# EAGLE design Side_ShortE (EAGLE 9.4.2)
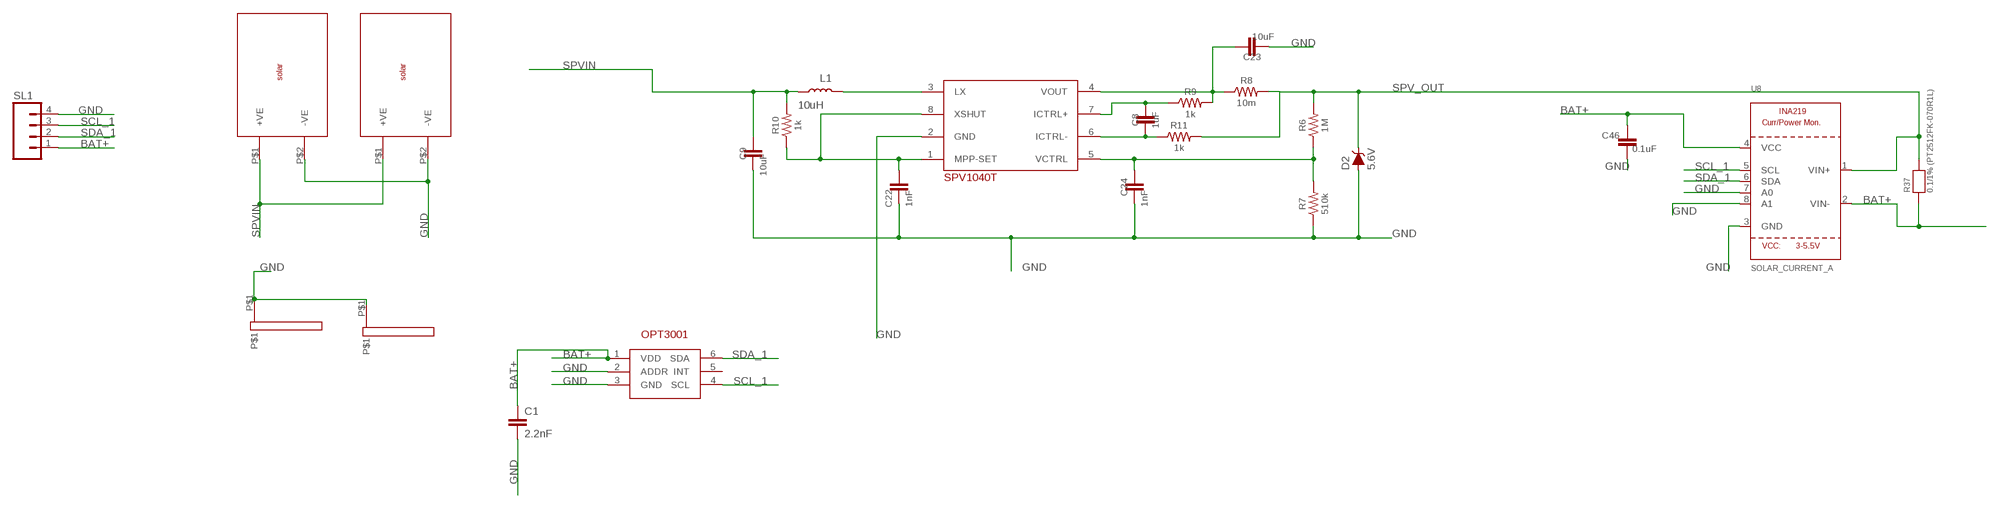
[diagram p0: schematic, sheet 1]

## Parts
C1  2.2nF  2.2NF/2200PF-0603-50V-10%  [0603]
C8  1uF  10UF-0603-6.3V-20%  [0603]
C9  10uF  10UF-0603-6.3V-20%  [0603]
C22  1nF  10UF-0603-6.3V-20%  [0603]
C23  10uF  10UF-0603-6.3V-20%  [0603]
C24  1nF  10UF-0603-6.3V-20%  [0603]
C46  0.1uF  10UF-0603-6.3V-20%  [0603]
D2  5.6V  DIODE-ZENER-MMSZ5232BS  [SOD-323]
L1  10uH  INDUCTOR-0603-33NH  [0603]
R6  1M  RC0603JR-070RL  [RES_0603]
R7  510k  RC0603JR-070RL  [RES_0603]
R8  10m  RC0603JR-070RL  [RES_0603]
R9  1k  RC0603JR-070RL  [RES_0603]
R10  1k  RC0603JR-070RL  [RES_0603]
R11  1k  RC0603JR-070RL  [RES_0603]
R37  0.1/1% (PT2512FK-070R1L)  RESISTOR2512  [2512]
SL1  M04  [04P]
SPV_A  SPV1040T_  [SOP65P640X120-8N]
U1  SON65P200X200X65-7N  [SON65P200X200X65-7N]
U8  SOLAR_CURRENT_A  INA219  [SOT23-8]
U$1  16X2  [16X2]
U$2  16X2  [16X2]
U$3  SOLAR_50_5_2  [FOOT]
U$4  SOLAR_50_5_2  [FOOT]

## Nets
BAT+ [vcc]: C1.1 C46.1 R37.1 SL1.1 U1.1(VDD) U8.2(VIN-) U8.4(VCC)
GND [vcc]: C1.2 C9.2 C22.2 C23.2 C24.2 C46.2 D2.A R7.1 SL1.4 SPV_A.2(GND) U1.2(ADDR) U1.3(GND) U8.3(GND) U8.7(A0) U8.8(A1) U$1.P$1 U$2.P$1 U$3.P$2(-VE) U$4.P$2(-VE)
N$5: L1.2 SPV_A.3(LX)
N$31: C22.1 R10.1 SPV_A.1(MPP-SET) SPV_A.8(XSHUT)
N$32: C24.1 R6.1 R7.2 SPV_A.5(VCTRL)
N$34: C8.2 R11.1 SPV_A.6(ICTRL-)
N$35: C8.1 R9.1 SPV_A.7(ICTRL+)
N$36: C23.1 R8.1 R9.2 SPV_A.4(VOUT)
SCL_1: SL1.3 U1.4(SCL) U8.5(SCL)
SDA_1: SL1.2 U1.6(SDA) U8.6(SDA)
SPV_OUT: D2.C R6.2 R8.2 R11.2 R37.2 U8.1(VIN+)
SPVIN: C9.1 L1.1 R10.2 U$3.P$1(+VE) U$4.P$1(+VE)
Unconnected: U1.5(INT)

## Library data of the parts
C1 = SparkFun-Capacitors:2.2NF/2200PF: 2.2nF/2,200pF ceramic capacitors A capacitor is a passive two-terminal electrical component used to store electrical energy temporarily in an electric field.; PROD_ID: CAP-07877
C8 C22 C24 C46 = SparkFun-Capacitors:10UF: 10.0µF ceramic capacitors A capacitor is a passive two-terminal electrical component used to store electrical energy temporarily in an electric field.; PROD_ID: CAP-11015; VALUE: 10uF
C9 C23 = SparkFun-Capacitors:10UF: 10.0µF ceramic capacitors A capacitor is a passive two-terminal electrical component used to store electrical energy temporarily in an electric field.; PROD_ID: CAP-11015
D2 = SparkFun-DiscreteSemi:DIODE-ZENER: Zener Diode A Zener diode allows current to flow from its anode to its cathode like a normal semiconductor diode, but it also permits current to flow in the reverse direction when its "Zener voltage" is reached. - WIkipedia; PROD_ID: DIO-12442
L1 = SparkFun-Coils:INDUCTOR: Inductors Resist changes in electrical current. Basically a coil of wire. SparkFun Products: SparkFun Load Cell Amplifier - HX711 <https://www.sparkfun.com/products/13879> IOIO-OTG - V2.2 <https://www.sparkfun.com/products/13613>; PROD_ID: NDUC-07874; VALUE: 33nH/±5%/500mA
R6-R11 = Resistor_Capacitor:RC0603JR-070RL: RES SMD 0 OHM JUMPER 1/10W 0603 Manufacturer's datasheet <http://www.yageo.com/documents/recent/PYu-RC_Group_51_RoHS_L_10.pdf>; CREATED_BY: PCBLayout.com; DIGIKEY_PART_NUMBER: 311-0.0GRTR-ND; MANUFACTURER: Yageo; MPN: RC0603JR-070RL; PACKAGE: SMD 0603
R37 = microbuilder:RESISTOR: Resistors 0402 - 0402 Surface Mount Package 22 Ohm 1% 1/16W [Digikey: 311-22.0LRTR-ND] 33 Ohm 5% 1/16W 1.0K 5% 1/16W 1.5K 5% 1/16W 2.0K 1% 1/16W 10.0K 1% 1/16W [Digikey: 311-10.0KLRTR-ND] 10.0K 5% 1/16W [Digikey: RMCF0402JT10K0TR-ND] 12.1K 1% 1/16W [Digikey: 311-22.0LRTR-ND] 100.0K 5% 1/16W 0603 - 0603 Surface Mount Package 0 Ohm 1/10 Watt 1% Resistor 15 Ohm 1/10 Watt 1% Resistor 33 Ohm 1/10 Watt 1% Resistor 49.9 Ohm 1/10 Watt 1% Resistor 100 Ohm 1/10 Watt 1% Resistor 150 Ohm 1/10 Watt 1% Resistor 240 Ohm 1/10 Watt 1% Resistor 390 Ohm 1/10 Watt 1% Resistor 560 Ohm 1/10 Watt 1% Resistor 680 Ohm 1/10 Watt 1% Resistor 750 Ohm 1/10 Watt 1% Resistor 1.0K Ohm 1/10 Watt 1% Resistor 1.5K Ohm 1/10 Watt 1% Resistor 2.0K Ohm 1/10 Watt 1% Resistor 2.2K Ohm 1/10 Watt 1% Resistor 3.3K Ohm 1/10 Watt 1% Resistor 4.7K Ohm 1/10 Watt 1% Resistor 10.0K Ohm 1/10 Watt 1% Resistor 12.0K Ohm 1/10 Watt 1% Resistor 12.1K Ohm 1/10 Watt 1% Resistor 20.0K Ohm 1/10 Watt 1% Resistor 33.0K Ohm 1/10 Watt 1% Resistor 100.0K Ohm 1/10 Watt 1% Resistor 0805 - 0805 Surface Mount Package 0 Ohm 1/8 Watt 1% Resistor 33 Ohm 1/8 Watt 1% Resistor 100 Ohm 1/8 Watt 1% Resistor 150 Ohm 1/8 Watt 1% Resistor 200 Ohm 1/8 Watt 1% Resistor 240 Ohm 1/8 Watt 1% Resistor 330 Ohm 1/8 Watt 1% Resistor 390 Ohm 1/8 Watt 1% Resistor 470 Ohm 1/8 Watt 1% Resistor 1.0K Ohm 1/8 Watt 1% Resistor 1.5K Ohm 1/8 Watt 1% Resistor 2.0K Ohm 1/8 Watt 1% Resistor 4.7K Ohm 1/8 Watt 1% Resistor 5.1K Ohm 1/8 Watt 1% Resistor 5.6K Ohm 1/8 Watt 1% Resistor 10.0K Ohm 1/8 Watt 1% Resistor 22.0K Ohm 1/8 Watt 1% Resistor 33.0K Ohm 1/8 Watt 1% Resistor 100K Ohm 1/8 Watt 1% Resistor 1206 - 1206 Surface Mount Package 2012 - 2010 Surface Mount Package 0.11 Ohm 1/2 Watt 1% Resistor - Digikey: RHM.11UCT-ND
SL1 = con-amp-quick:M04: AMP QUICK CONNECTOR; OC_FARNELL: unknown; OC_NEWARK: unknown
SPV_A = SPV1040T:SPV1040T_
U1 = SON65P200X200X65-7N:SON65P200X200X65-7N; A_MAX: 0.65; B_MAX: 0.3; B_MIN: 0.2; B_NOM: 0.25; D2_NOM: 1.35; D_MAX: 2.075; D_MIN: 1.925; D_NOM: 2.0; E2_NOM: 0.65; ENOM: 0.65; E_MAX: 2.075; E_MIN: 1.925; E_NOM: 2.0; L_MAX: 0.35; L_MIN: 0.25; L_NOM: 0.3; MANUFACTURER: Maxim Integrated; PIN_COUNT: 6.0; SNAPEDA_PACKAGE_ID: 71138; STANDARD: IPC 7351B
U8 = microbuilder:INA219: INA219 - I2C Current/Power Monitor Voltage Range: 0-26V Accuracy: 0.5% Temperature: -40°C - 125°C
U$1 U$2 = 16x2PAD:16X2: Pad for 90 degree solder
U$3 U$4 = solar_50_5_2:SOLAR_50_5_2

## Net classes
1 vcc: width 0.254 mm

## Board
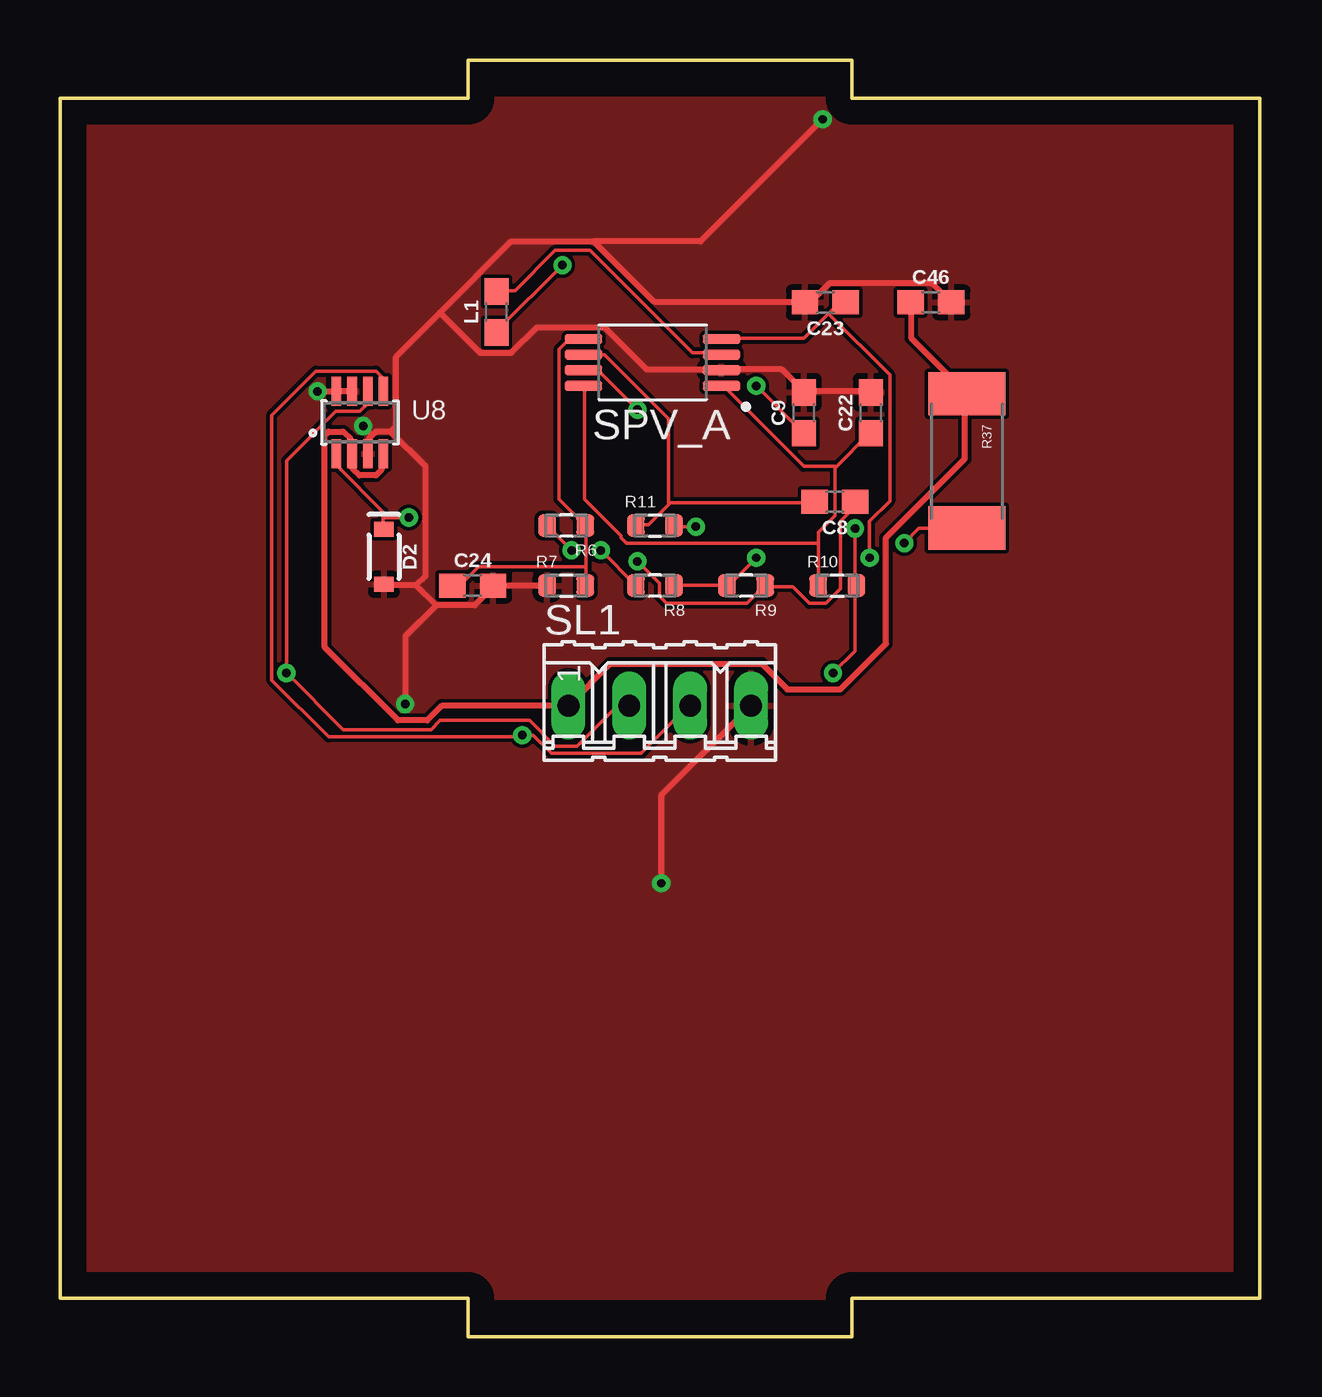
[diagram p1: board, top side]
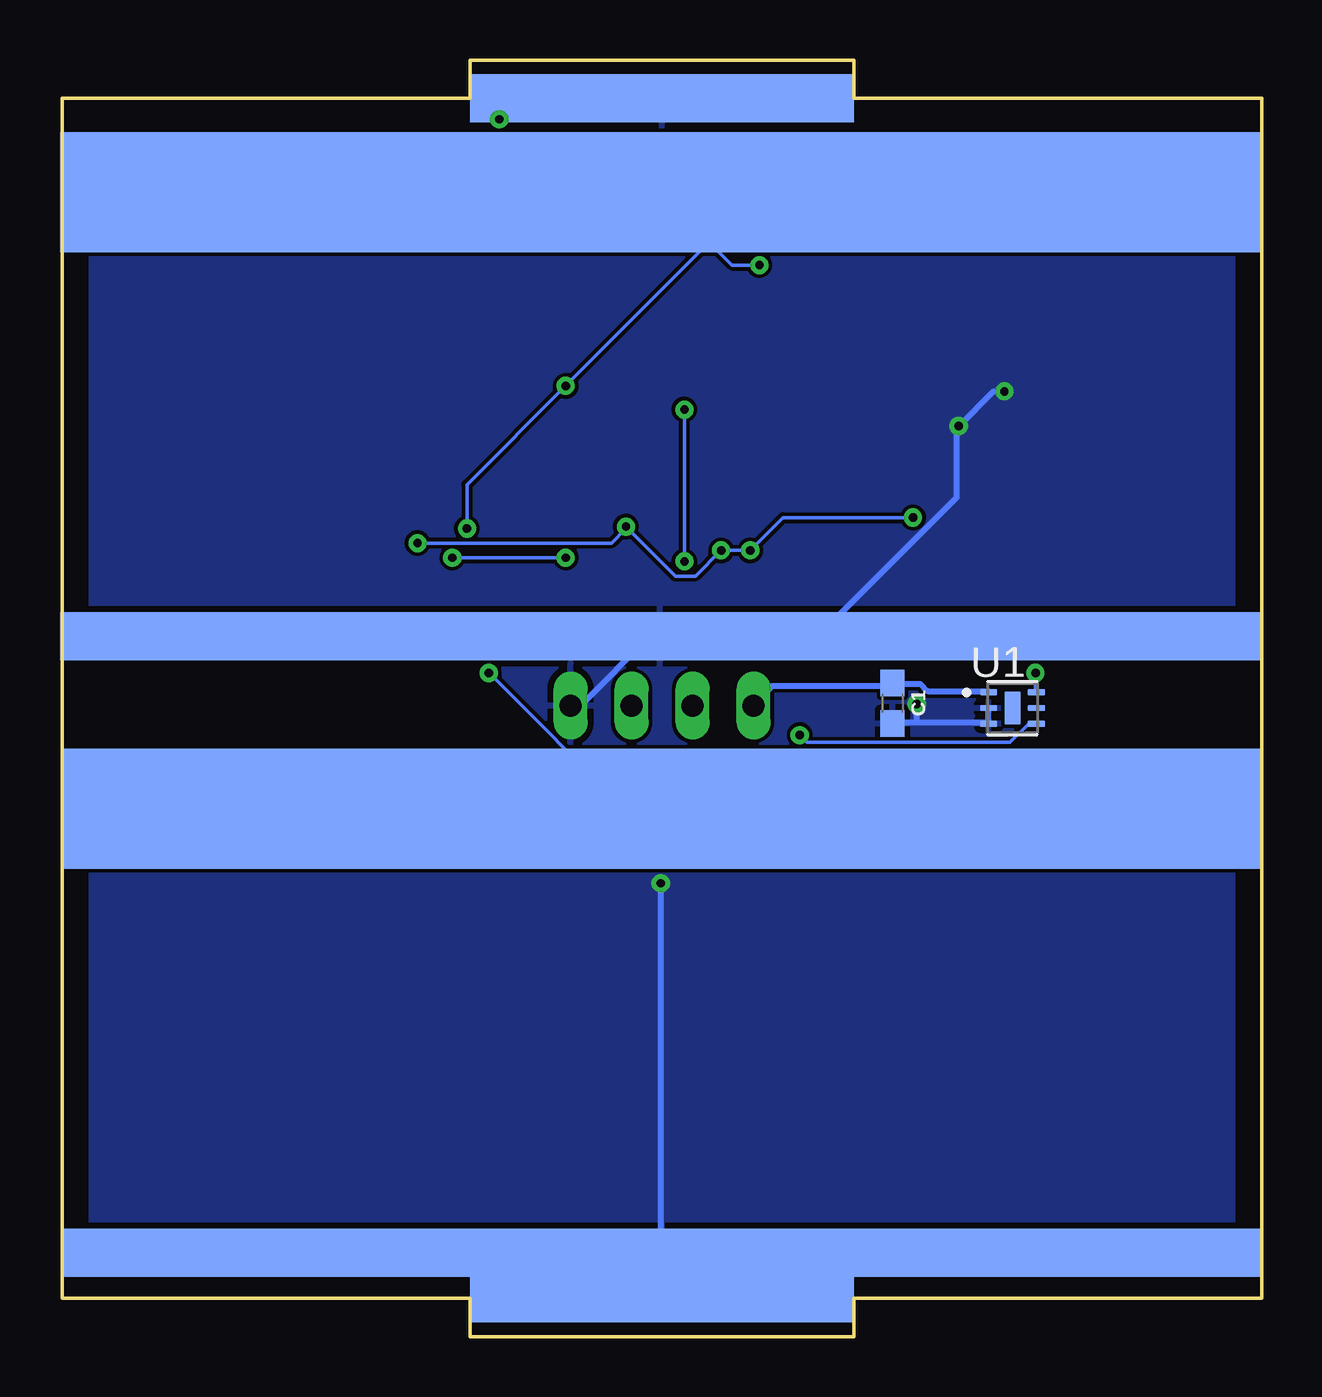
[diagram p2: board, bottom side, seen from below]

Size 50 x 53.2 mm. Coordinates in mm from the lower left corner, seen from the top.
Outline: 0,1.6 17,1.6 17,0 33,0 33,1.6 50,1.6 50,51.6 33,51.6 33,53.2 17,53.2 17,51.6 0,51.6 0,1.6
Copper layers (1*16): Top 0.035mm / dielectric 1.5mm / Bottom 0.035mm
Design rules "default *": minimum track width 6mil, minimum drill 0.35mm, track to track 6mil, track to pad 6mil, pad to pad 6mil, via to via 6mil, smd to smd 6mil, copper to edge 40mil, drill to drill 6mil, minimum pad ring 10mil, minimum via ring 8mil, stop-mask expansion 4mil, vias tented up to drill 0mil, thermal gap 10mil

### Footprints (pad centres in the part's own frame; a part is rotated, then mirrored left to right if it is on the bottom)
0603 = smd 1.1 x 1: 1 -0.85,0; 2 0.85,0
SOD-323 = smd 0.63 x 0.83: A 1.15,0; C -1.15,0
RES_0603 = smd 0.74 x 0.93: 1 -0.795,0; 2 0.795,0
2512 = smd 1.8 x 3.2: 1 -2.8,0; 2 2.8,0
04P = drill 0.914 long: 1 -3.81,0; 2 -1.27,0; 3 1.27,0; 4 3.81,0
SOP65P640X120-8N = smd 1.56 x 0.41: 1 -2.88,0.975; 2 -2.88,0.325; 3 -2.88,-0.325; 4 -2.88,-0.975; 5 2.88,-0.975; 6 2.88,-0.325; 7 2.88,0.325; 8 2.88,0.975
SON65P200X200X65-7N = smd 0.72 x 0.27: 1 -0.995,0.65; 2 -0.995,0; 3 -0.995,-0.65; 4 0.995,-0.65; 5 0.995,0; 6 0.995,0.65 | smd 0.65 x 1.35: 7 0,0
SOT23-8 = smd 0.4 x 1.2: 1 -0.975,-1.3; 2 -0.325,-1.3; 3 0.325,-1.3; 4 0.975,-1.3; 5 0.975,1.3; 6 0.325,1.3; 7 -0.325,1.3; 8 -0.975,1.3
16X2 = smd 16 x 2: P$1 0,0
FOOT = smd 50 x 5: P$1 0,0 | smd 50 x 2: P$2 0,18.5

### Placement (x,y rotation side)
C1  15.4,26.4 270 bottom
C8  32.3,34.8 180 top
C9  31,38.5 90 top
C22  33.8,38.5 90 top
C23  31.9,43.1 180 top
C24  17.2,31.3 0 top
C46  36.3,43.1 0 top
D2  13.5,32.5 270 top
L1  18.2,42.7 90 top
R6  21.1,33.8 180 top
R7  21.1,31.3 0 top
R8  24.8,31.3 180 top
R9  28.6,31.3 180 top
R10  32.4,31.3 0 top
R11  24.8,33.8 0 top
R37  37.8,36.5 270 top
SL1  25,26.3 0 top
SPV_A  24.7,40.6 180 top
U1  10.4,26.2 0 bottom
U8  12.5,38.1 0 top
U$1  25,51.6 0 bottom
U$2  25,1.6 0 bottom
U$3  25.1,47.7 180 bottom
U$4  25,22 180 bottom

### Tracks (layer width: path | path; a pad name or v marks a point on that pad's centre or on a via)
BAT+
  Top 0.254: C46.1 35.5,43.05 35.5,41.61 37.79,39.32 R37.1 37.71,39.24 37.71,36.58 34.43,33.3 34.43,28.88 32.53,26.98 30.32,26.98 29.25,28.04 22.93,28.04 21.25,26.37 SL1.1 21.17,26.29 15.92,26.29 15.31,25.68 14.09,25.68 11.04,28.73 11.04,37.57 11.19,37.72 11.8,37.72 12.11,37.41 12.11,36.88 U8.2 12.18,36.73 12.18,36.2 12.49,35.89 13.17,35.89 13.4,36.12 13.4,36.73 U8.4
  Bottom 0.254: U1.1 11.42,26.9 13.94,26.9 14.24,27.2 15.38,27.2 C1.1 15.46,27.13 20.41,27.13 21.17,26.37 SL1.1
GND  (via drill 0.35)
  Top 0.254: C22.2 33.75,39.4 31,39.4 C9.2 30.93,39.47 30.09,40.31 27.65,40.31 SPV_A.2 27.5,40.31 24.45,40.31 22.7,42.06 19.88,42.06 18.81,41 17.52,41 15.84,42.67 | C46.2 37.1,43.13 36.34,43.89 32.07,43.89 31.31,43.13 31.08,43.13 C23.2 30.93,43.13 24.76,43.13 22.24,45.64 | U8.7 12.11,39.4 11.57,39.4 U8.8 11.42,39.4 v10.73,39.4 | 14.85,31.32 13.55,31.32 D2.A | 15.69,30.48 14.85,31.32 | 15.69,30.48 17.29,30.48 18.05,31.24 C24.2 18.13,31.32 20.26,31.32 R7.1 | 13.02,37.57 13.17,37.72 13.78,37.72 | 13.02,37.57 12.87,37.41 12.87,36.8 U8.3 | 13.78,37.72 15.23,36.27 15.23,31.7 14.85,31.32 | 13.02,37.57 v12.64,37.95 | v14.39,26.37 14.39,29.18 15.69,30.48 | 22.24,45.64 18.81,45.64 15.84,42.67 | 15.84,42.67 14.01,40.84 14.01,37.95 13.78,37.72 | v25.06,18.9 25.06,22.55 28.79,26.29 SL1.4 | v31.79,50.73 26.7,45.64 22.24,45.64
  Bottom 0.254: U$2.P$1 25.06,1.6 25.06,3.43 U$4.P$2 25.06,3.58 v25.06,18.9 | U1.2 11.42,26.14 11.42,25.6 U1.3 11.5,25.6 14.39,25.6 | 14.39,25.6 15.38,25.6 C1.2 | v10.73,39.4 11.19,39.4 v12.64,37.95 12.72,37.87 12.72,34.98 18.51,29.18 24.98,29.18 U$3.P$2 25.14,29.18 25.52,29.18 28.34,26.37 28.79,26.37 SL1.4 | v14.39,26.37 14.39,25.6 | U$1.P$1 30.92,51.6 v31.79,50.73
  pour Top: 0,1.6 0,51.6 50,51.6 50,1.6
  pour Bottom: 0,1.6 0,51.6 50,51.6 50,1.6
N$5
  Top 0.152: L1.2 18.2,43.59 18.96,43.59 20.64,45.26 22.09,45.26 26.36,41 27.57,41 SPV_A.3
N$31
  Top 0.152: 31.61,33.07 31.61,33.53 32.3,34.21 32.3,36.2 32.34,36.23 | 31.61,33.07 31.61,31.32 R10.1 | 32.34,36.23 33.75,37.64 C22.1 | 31.61,33.07 23.61,33.07 23.38,33.3 23.38,33.38 21.86,34.9 21.86,39.62 SPV_A.8 | SPV_A.1 27.65,39.62 31,36.27 32.3,36.27 32.34,36.23
N$32
  Top 0.152: 21.94,32.08 21.94,33.76 R6.1 21.86,33.83 20.79,34.9 20.79,41.15 21.17,41.53 21.78,41.53 SPV_A.5 | 21.94,32.08 21.94,31.32 R7.2 | 21.94,32.08 17.44,32.08 16.68,31.32 16.37,31.32 C24.1
N$34
  Top 0.152: 25.4,34.71 25.44,34.75 31.38,34.75 C8.2 | 25.4,34.71 24.53,33.83 24.07,33.83 R11.1 | SPV_A.6 21.86,40.92 22.7,40.92 25.36,38.25 25.36,34.75 25.4,34.71
N$35  (via drill 0.35)
  Top 0.152: C8.1 33.14,34.75 33.14,34.59 32.53,33.98 32.53,31.17 31.92,30.56 31.23,30.56 30.55,31.24 29.4,31.24 R9.1 29.33,31.24 28.64,30.56 25.29,30.56 24.98,30.86 24.98,31.39 v24.07,32.31 | v24.07,38.63 22.47,40.23 21.86,40.23 SPV_A.7
  Bottom 0.152: v24.07,32.31 v24.07,38.63
N$36  (via drill 0.35)
  Top 0.152: R8.1 25.67,31.32 27.8,31.32 R9.2 27.88,31.32 v29.02,32.46 | 32.03,42.63 31,41.61 27.65,41.61 SPV_A.4 | 32.03,42.63 32.45,43.05 32.68,43.05 C23.1 | v33.75,32.46 33.75,33.98 34.59,34.82 34.59,40.08 32.03,42.63
  Bottom 0.152: v33.75,32.46 v29.02,32.46
SCL_1  (via drill 0.35)
  Top 0.152: SL1.3 26.2,26.29 24.22,24.31 20.49,24.31 19.73,25.07 v19.27,25.07 19.19,24.99 11.19,24.99 8.83,27.36 8.83,38.41 10.66,40.23 13.17,40.23 13.4,40.01 13.4,39.47 U8.5
  Bottom 0.152: v19.27,25.07 18.96,24.77 10.51,24.77 9.74,25.53 9.44,25.53 U1.4
SDA_1  (via drill 0.35)
  Top 0.152: U8.6 12.79,39.4 12.79,38.86 12.49,38.56 11.5,38.56 9.44,36.5 v9.44,27.66 11.8,25.3 15.46,25.3 15.84,25.68 19.57,25.68 20.64,24.61 21.55,24.61 23.23,26.29 23.69,26.29 SL1.2
  Bottom 0.152: v9.44,27.66 9.44,26.9 U1.6
SPV_OUT  (via drill 0.35)
  Top 0.152: 13.48,34.14 13.48,34.37 11.57,36.27 11.57,36.73 U8.1 | 13.48,34.14 13.48,33.68 D2.C | v21.33,32.77 20.34,33.76 R6.2 | v22.55,32.77 23.99,31.32 R8.2 | v26.51,33.76 25.67,33.76 R11.2 | v14.54,34.14 13.48,34.14 | v35.2,33.07 35.8,33.68 37.79,33.68 R37.2
  Bottom 0.152: v14.54,34.14 19.95,34.14 v21.33,32.77 v22.55,32.77 23.61,31.7 24.45,31.7 v26.51,33.76 26.51,33.68 27.12,33.07 v35.2,33.07
SPVIN  (via drill 0.35)
  Top 0.152: v32.22,27.66 33.14,28.58 33.14,31.24 R10.2 33.14,31.32 v33.14,33.68 | v20.95,44.65 18.2,41.91 L1.1 | v29.02,39.62 30.93,37.72 C9.1
  Bottom 0.152: v32.22,27.66 26.58,22.02 25.06,22.02 U$4.P$1 | v20.95,44.65 22.09,44.65 25.06,47.62 U$3.P$1 23.08,45.57 v29.02,39.62 33.14,35.51 v33.14,33.68